# Altium schematic sheet simController.SchDoc
size A2
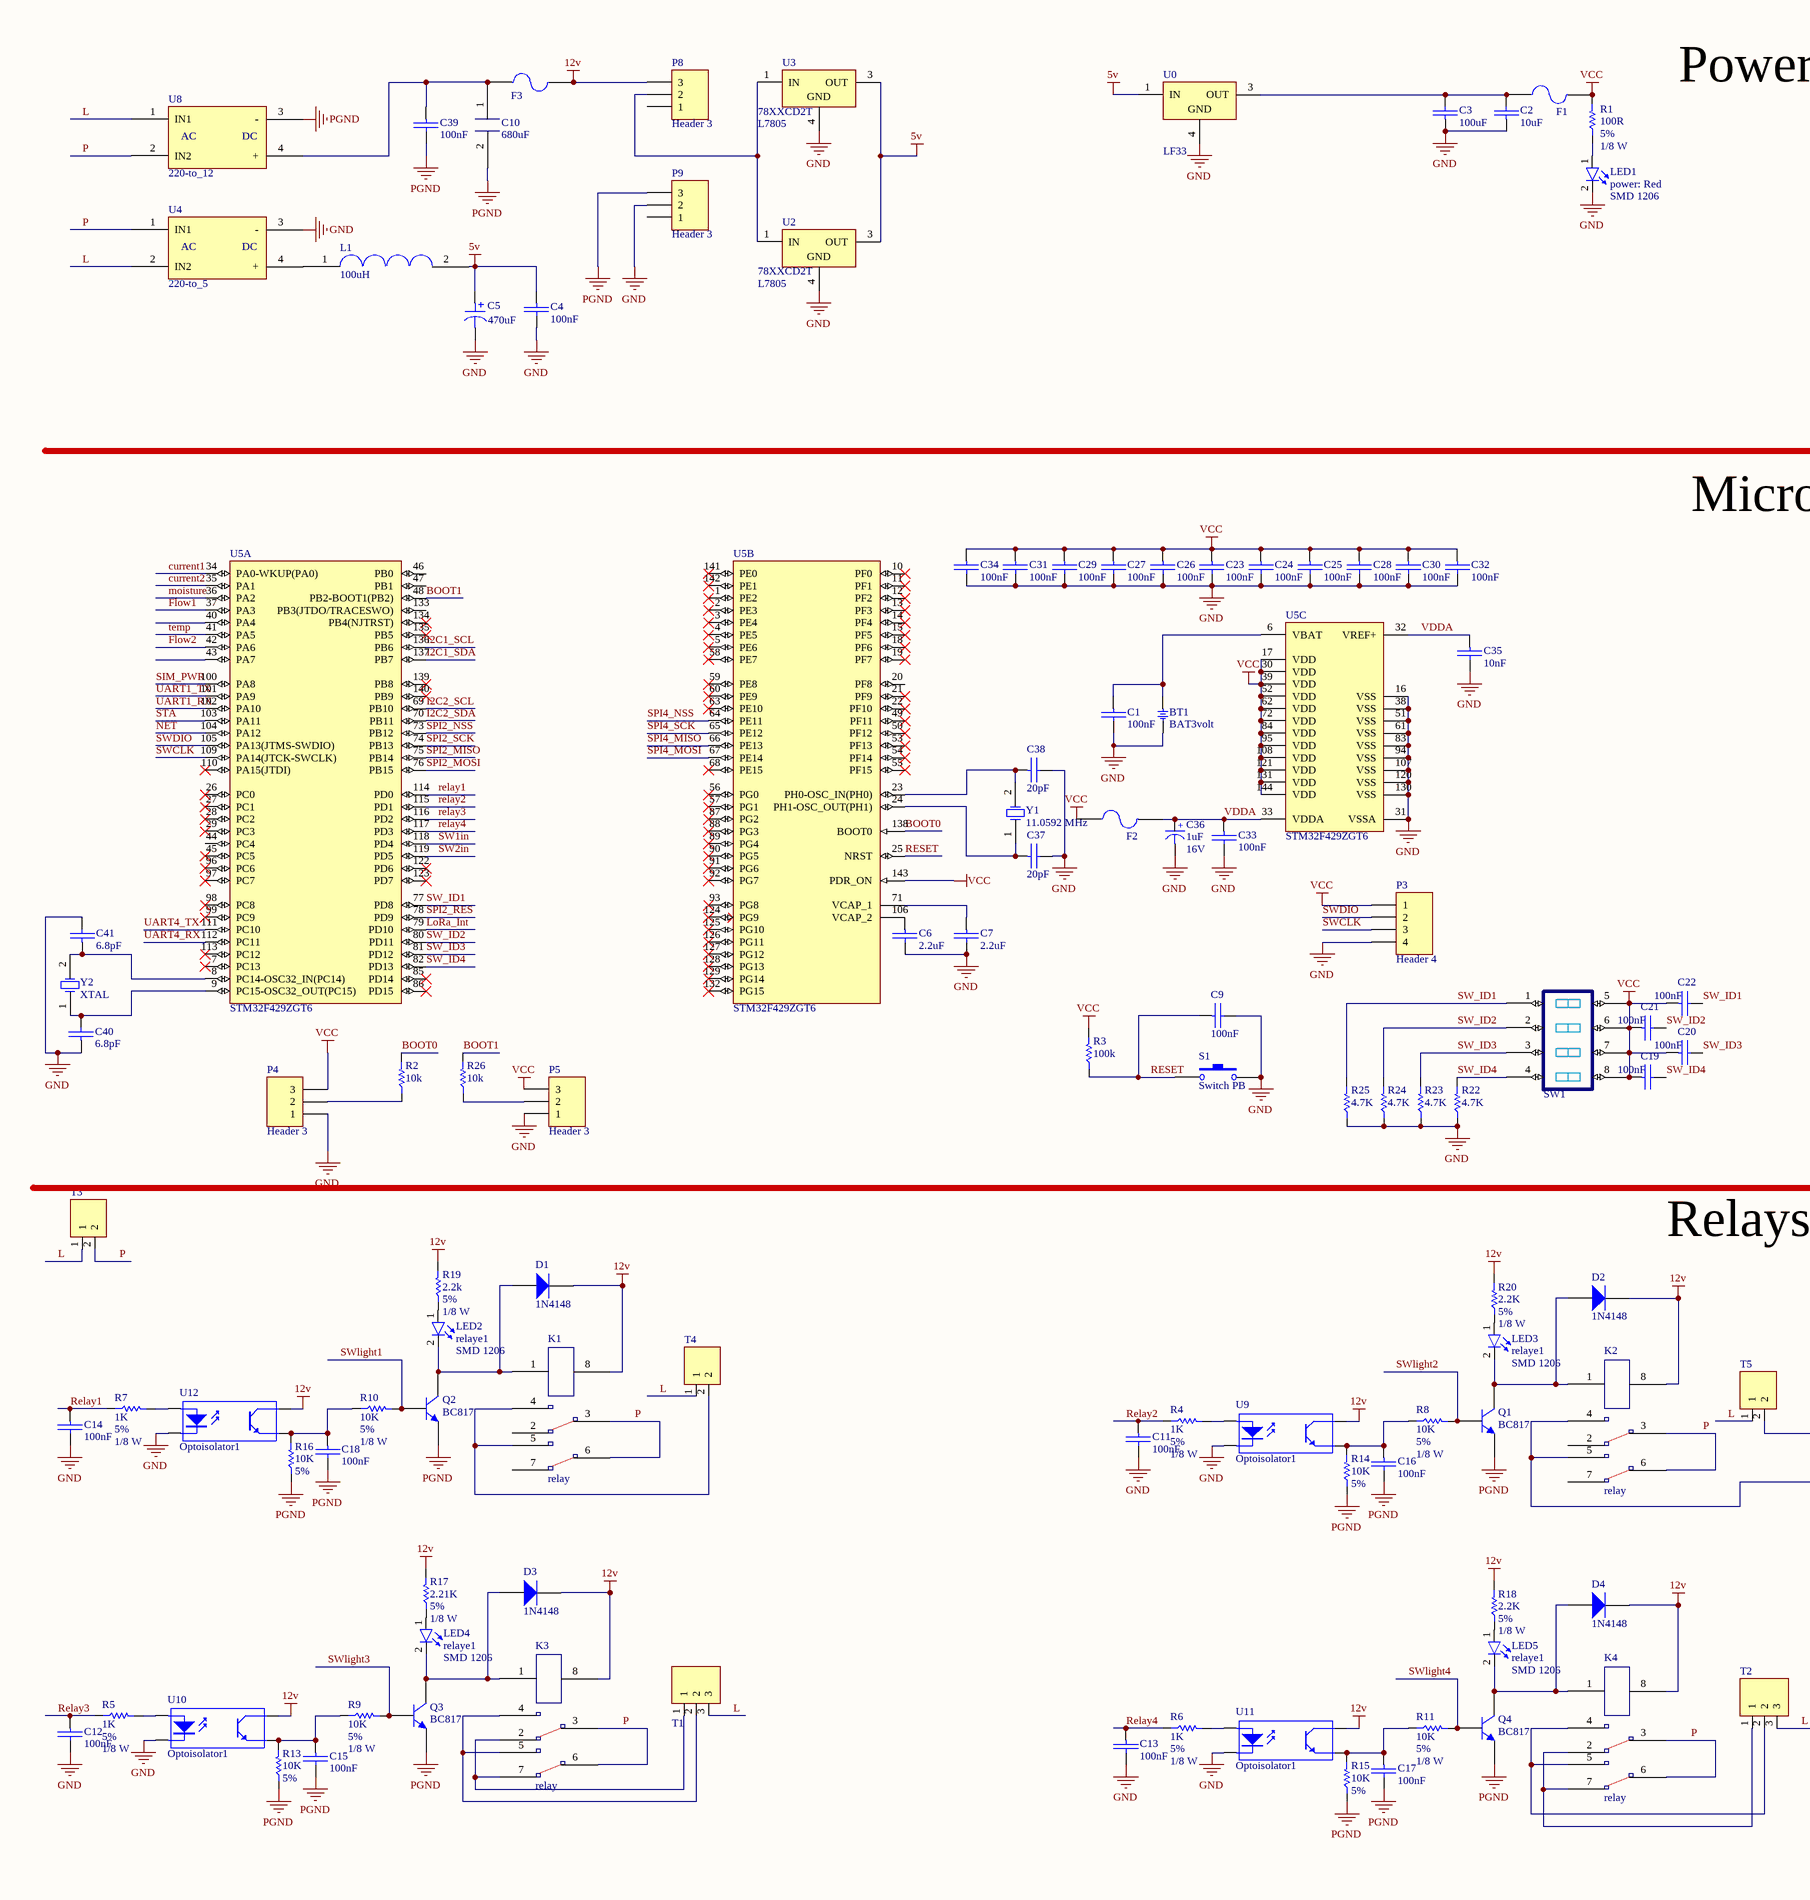
[diagram p0: simController.SchDoc, left]
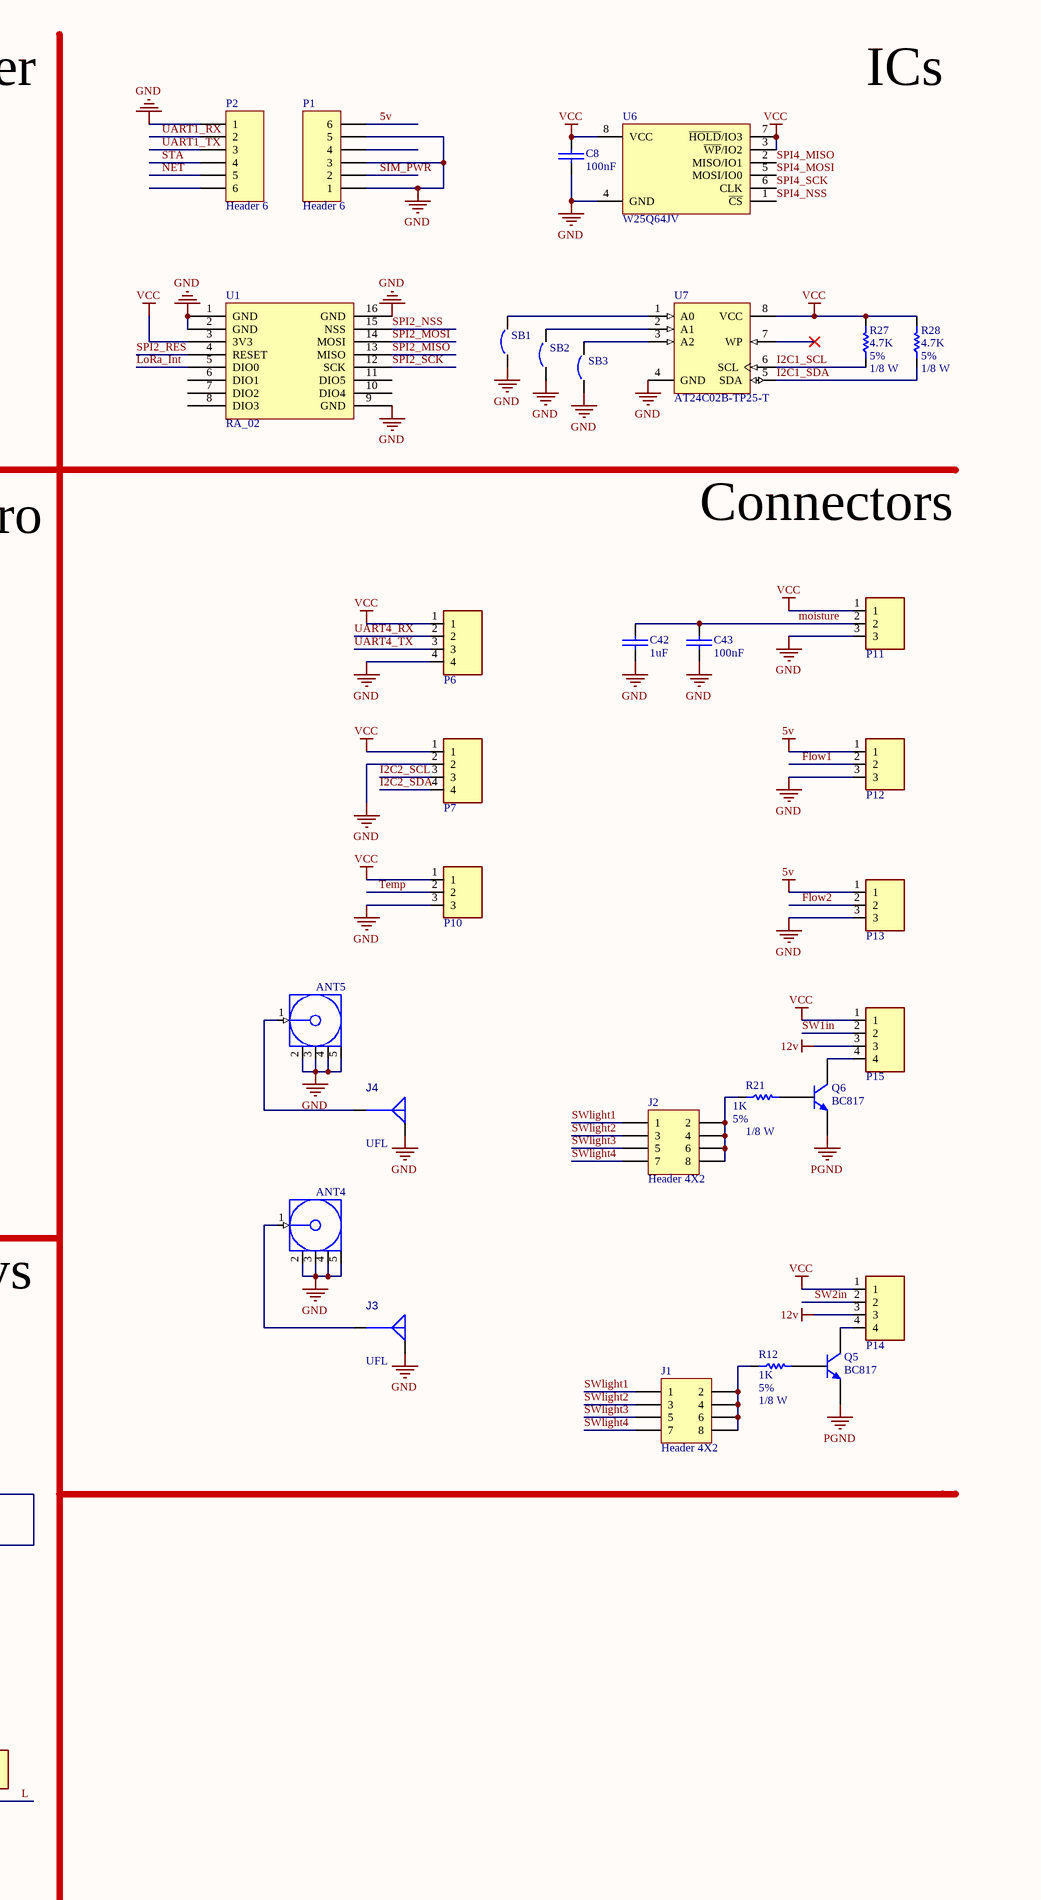
[diagram p1: simController.SchDoc, right]

## Parts
ANT4  SMA  [SMA]  (value not drawn)
ANT5  SMA  [SMA]  (value not drawn)
BT1  BAT3volt  [BTH1220_2032]
C1  100nF  [SMD_CAP_0805]
C2  10uF  [SMD_CAP_0805]
C3  100uF  [SMD_CAP_0805]
C4  100nF  [SMD_CAP_0805]
C5  470uF  [CAP TAN SMD 7343]
C6  2.2uF  [SMD_CAP_0805]
C7  2.2uF  [SMD_CAP_0805]
C8  100nF  [C0805]
C9  100nF  [SMD_CAP_0805]
C10  680uF  [CAP AL SMD D10 H10]
C11  100nF  [C0805]
C12  100nF  [C0805]
C13  100nF  [C0805]
C14  100nF  [C0805]
C15  100nF  [C0805]
C16  100nF  [C0805]
C17  100nF  [C0805]
C18  100nF  [C0805]
C19  100nF  [C0805]
C20  100nF  [C0805]
C21  100nF  [C0805]
C22  100nF  [C0805]
C23  100nF  [SMD_CAP_0805]
C24  100nF  [SMD_CAP_0805]
C25  100nF  [SMD_CAP_0805]
C26  100nF  [SMD_CAP_0805]
C27  100nF  [SMD_CAP_0805]
C28  100nF  [SMD_CAP_0805]
C29  100nF  [SMD_CAP_0805]
C30  100nF  [SMD_CAP_0805]
C31  100nF  [SMD_CAP_0805]
C32  100nF  [SMD_CAP_0805]
C33  100nF  [SMD_CAP_0805]
C34  100nF  [SMD_CAP_0805]
C35  10nF  [SMD_CAP_0805]
C36  Voltage: 16V  [CAPP 1206 (3216X18L) Size A]  (hidden comment: 1uF)
C37  20pF  [SMD_CAP_0805]
C38  20pF  [SMD_CAP_0805]
C39  100nF  [SMD_CAP_0805]
C40  6.8pF  [SMD_CAP_0805]
C41  6.8pF  [SMD_CAP_0805]
C42  1uF  [C0805]
C43  100nF  [C0805]
D1  1N4148  [LL4148]
D2  1N4148  [LL4148]
D3  1N4148  [LL4148]
D4  1N4148  [LL4148]
F1  F=1.0 A  [0805L]  (value not drawn)
F2  F=1.0 A  [1206 FUSE]  (value not drawn)
F3  F=1.0 A  [0805L]  (value not drawn)
J1  Header 4X2  [HDR2X4]
J2  Header 4X2  [HDR2X4]
J3  UFL  [MOLEX SD-734120110]
J4  UFL  [MOLEX SD-734120110]
K1  relay  [relay8pin_omron]
K2  relay  [relay8pin_omron]
K3  relay  [relay8pin_omron]
K4  relay  [relay8pin_omron]
L1  100uH  [INDP11595X40N]
LED1  power: Red  Size: SMD 1206  [LED SMD 1206]
LED2  power: relaye1  Size: SMD 1206  [LED SMD 1206]
LED3  power: relaye1  Size: SMD 1206  [LED SMD 1206]
LED4  power: relaye1  Size: SMD 1206  [LED SMD 1206]
LED5  power: relaye1  Size: SMD 1206  [LED SMD 1206]
P1  Header 6  [HDR1X6]
P2  Header 6  [HDR1X6]
P3  Header 4  [HDR1X4]
P4  Header 3  [HDR1X3]
P5  Header 3  [HDR1X3]
P6  CONN_PWL_4  [XH_4_P2.0]  (value not drawn)
P7  CONN_PWL_4  [XH_4_P2.0]  (value not drawn)
P8  Header 3  [HDR1X3]
P9  Header 3  [HDR1X3]
P10  CONN_PWL_3  [XH_3_P2.0]  (value not drawn)
P11  CONN_PWL_3  [XH_3_P2.0]  (value not drawn)
P12  CONN_PWL_3  [XH_3_P2.0]  (value not drawn)
P13  CONN_PWL_3  [XH_3_P2.0]  (value not drawn)
P14  CONN_PWL_4  [XH_4_P2.0]  (value not drawn)
P15  CONN_PWL_4  [XH_4_P2.0]  (value not drawn)
Q1  BC817  [SOT23_BEC_M]
Q2  BC817  [SOT23_BEC_M]
Q3  BC817  [SOT23_BEC_M]
Q4  BC817  [SOT23_BEC_M]
Q5  BC817  [SOT23_BEC_M]
Q6  BC817  [SOT23_BEC_M]
R1  Tolerance: 5%  Power: 1/8 W  [RES 0805 (2012X06L)]  (hidden comment: 100R)
R2  10k  [RES 0805 (2012X06L)]
R3  100k  [RES 0805 (2012X06L)]
R4  Tolerance: 5%  Power: 1/8 W  [RES 0805 (2012X06L)]  (hidden comment: 1K)
R5  Tolerance: 5%  Power: 1/8 W  [RES 0805 (2012X06L)]  (hidden comment: 1K)
R6  Tolerance: 5%  Power: 1/8 W  [RES 0805 (2012X06L)]  (hidden comment: 1K)
R7  Tolerance: 5%  Power: 1/8 W  [RES 0805 (2012X06L)]  (hidden comment: 1K)
R8  Tolerance: 5%  Power: 1/8 W  [RES 0805 (2012X06L)]  (hidden comment: 10K)
R9  Tolerance: 5%  Power: 1/8 W  [RES 0805 (2012X06L)]  (hidden comment: 10K)
R10  Tolerance: 5%  Power: 1/8 W  [RES 0805 (2012X06L)]  (hidden comment: 10K)
R11  Tolerance: 5%  Power: 1/8 W  [RES 0805 (2012X06L)]  (hidden comment: 10K)
R12  Tolerance: 5%  Power: 1/8 W  [RES 0805 (2012X06L)]  (hidden comment: 1K)
R13  Tolerance: 5%  [RES 0805 (2012X06L)]  (hidden comment: 10K)
R14  Tolerance: 5%  [RES 0805 (2012X06L)]  (hidden comment: 10K)
R15  Tolerance: 5%  [RES 0805 (2012X06L)]  (hidden comment: 10K)
R16  Tolerance: 5%  [RES 0805 (2012X06L)]  (hidden comment: 10K)
R17  Tolerance: 5%  Power: 1/8 W  [RES1206]  (hidden comment: 2.21K)
R18  Tolerance: 5%  Power: 1/8 W  [RES1206]  (hidden comment: 2.2K)
R19  Tolerance: 5%  Power: 1/8 W  [RES1206]  (hidden comment: 2.2k)
R20  Tolerance: 5%  Power: 1/8 W  [RES1206]  (hidden comment: 2.2K)
R21  Tolerance: 5%  Power: 1/8 W  [RES 0805 (2012X06L)]  (hidden comment: 1K)
R22  4.7K  [6-0805_N]
R23  4.7K  [6-0805_N]
R24  4.7K  [6-0805_N]
R25  4.7K  [6-0805_N]
R26  10k  [RES 0805 (2012X06L)]
R27  Tolerance: 5%  Power: 1/8 W  [RES 0805 (2012X06L)]  (hidden comment: 4.7K)
R28  Tolerance: 5%  Power: 1/8 W  [RES 0805 (2012X06L)]  (hidden comment: 4.7K)
S1  Switch PB  [Switch - Push to On]
SB1  Solder Bridge  [Solder Bridge]  (value not drawn)
SB2  Solder Bridge  [Solder Bridge]  (value not drawn)
SB3  Solder Bridge  [Solder Bridge]  (value not drawn)
SW1  DIP_SW_SMD_4PORT  [DIP_SW_SMD_4]  (value not drawn)
T1  CONN_PWL_3  [MSTBV 2,5/3-G-5]  (value not drawn)
T2  CONN_PWL_3  [MSTBV 2,5/3-G-5]  (value not drawn)
T3  CONN_PWL_2  [MSTBV 2,5/2-G-5]  (value not drawn)
T4  CONN_PWL_2  [MSTBV 2,5/2-G-5]  (value not drawn)
T5  CONN_PWL_2  [MSTBV 2,5/2-G-5]  (value not drawn)
U0  LF33  [TO-252]
U1  RA_02  [CAF-200P1700X1900-16N]
U2  78XXCD2T  PartNumber: L7805  [TO263-3]
U3  78XXCD2T  PartNumber: L7805  [TO263-3]
U4  220-to_5  [220to5_3W]
U5  STM32F429ZGT6  [STM-LQFP144_N]  (parts A,B,C of 3)
U6  W25Q64JV  [SOIC-8 5.28X5.28MM P1.27MM]
U7  AT24C02B-TP25-T  [SO8_N]
U8  220-to_12  [220to12_3W]
U9  Optoisolator1  [DIP-4]
U10  Optoisolator1  [DIP-4]
U11  Optoisolator1  [DIP-4]
U12  Optoisolator1  [DIP-4]
Y1  11.0592 MHz  [Crystal SMD]
Y2  XTAL  [R38]

## Nets
5v: C4.2(-) C5.1 L1.2 P1.6 P12.1 P13.1 U0.1(IN) U2.3(OUT) U3.3(OUT)
12v: D1.2(K) D2.2(K) D3.2(K) D4.2(K) F3.2 K1.8 K2.8 K3.8 K4.8 P8.3 P14.3 P15.3 R17.2 R18.2 R19.2 R20.2 U9.4(C) U10.4(C) U11.4(C) U12.4(C)
GND: ANT4.2(GND) ANT4.3(GND) ANT4.4(GND) ANT4.5(GND) ANT5.2(GND) ANT5.3(GND) ANT5.4(GND) ANT5.5(GND) BT1.2 C1.1(+) C2.2(-) C3.2(-) C4.1(+) C5.2 C6.1(+) C7.1(+) C8.1(+) C9.1(+) C11.1(+) C12.1(+) C13.1(+) C14.1(+) C23.1(+) C24.1(+) C25.1(+) C26.1(+) C27.1(+) C28.1(+) C29.1(+) C30.1(+) C31.1(+) C32.1(+) C33.1(+) C34.1(+) C35.1(+) C36.2(-) C37.1(+) C38.1(+) C40.2(-) C41.1(+) C42.1(+) C43.1(+) J3.G J4.G LED1.2(K) P1.1 P1.3 P1.5 P2.1 P3.4 P4.1 P5.1 P6.4 P7.2 P9.2 P10.3 P11.3 P12.3 P13.3 R22.1 R23.1 R24.1 R25.1 S1.2 SB1.1 SB2.1 SB3.1 U0.4(GND) U1.1(GND) U1.2(GND) U1.9(GND) U1.16(GND) U2.4 U3.4 U4.3(-) U5.16(VSS) U5.31(VSSA) U5.38(VSS) U5.51(VSS) U5.61(VSS) U5.83(VSS) U5.94(VSS) U5.107(VSS) U5.120(VSS) U5.130(VSS) U6.4(GND) U7.4(GND) U9.2(K) U10.2(K) U11.2(K) U12.2(K)
PGND: C10.2 C15.1(+) C16.1(+) C17.1(+) C18.1(+) C39.1(+) P9.3 Q1.2(E) Q2.2(E) Q3.2(E) Q4.2(E) Q5.2(E) Q6.2(E) R13.1 R14.1 R15.1 R16.1 U8.3(-)
VCC: C8.2(-) C19.2(-) C20.2(-) C21.2(-) C22.2(-) C23.2(-) C24.2(-) C25.2(-) C26.2(-) C27.2(-) C28.2(-) C29.2(-) C30.2(-) C31.2(-) C32.2(-) C34.2(-) F1.1 F2.2 P3.1 P4.3 P5.3 P6.1 P7.1 P10.1 P11.1 P14.1 P15.1 R1.2 R3.2 R27.2 R28.2 SW1.5(1R) SW1.6(2R) SW1.7(3R) SW1.8(4R) U1.3(3V3) U5.17(VDD) U5.30(VDD) U5.39(VDD) U5.52(VDD) U5.62(VDD) U5.72(VDD) U5.84(VDD) U5.95(VDD) U5.108(VDD) U5.121(VDD) U5.131(VDD) U5.143(PDR_ON) U5.144(VDD) U6.3(~{WP}/IO2) U6.7(~{HOLD}/IO3) U6.8(VCC) U7.8(VCC)
BOOT0: R2.2 U5.138(BOOT0)
BOOT1: R26.2 U5.48(PB2-BOOT1(PB2))
current1: U5.34(PA0-WKUP(PA0))
current2: U5.35(PA1)
Flow1: P12.2 U5.37(PA3)
Flow2: P13.2 U5.42(PA6)
I2C1_SCL: R27.1 U5.136(PB6) U7.6(SCL)
I2C1_SDA: R28.1 U5.137(PB7) U7.5(SDA)
I2C2_SCL: P7.3 U5.69(PB10)
I2C2_SDA: P7.4 U5.70(PB11)
L: T1.3 T2.3 T3.1 T4.1 T5.1 U4.2(IN2) U8.1(IN1)
LoRa_Int: U1.5(DIO0) U5.79(PD10)
moisture: C42.2(-) C43.2(-) P11.2 U5.36(PA2)
NET: P2.5 U5.104(PA12)
P: K1.3 K1.6 K2.3 K2.6 K3.3 K3.6 K4.3 K4.6 T3.2 U4.1(IN1) U8.2(IN2)
relay1: C14.2(-) R7.1 U5.114(PD0)
Relay2: C11.2(-) R4.1 U5.115(PD1)
Relay3: C12.2(-) R5.1 U5.116(PD2)
Relay4: C13.2(-) R6.1 U5.117(PD3)
RESET: C9.2(-) R3.1 S1.1 U5.25(NRST)
SIM_PWR: P1.2 U5.100(PA8)
SPI2_MISO: U1.13(MISO) U5.75(PB14)
SPI2_MOSI: U1.14(MOSI) U5.76(PB15)
SPI2_NSS: U1.15(NSS) U5.73(PB12)
SPI2_RES: U1.4(RESET) U5.78(PD9)
SPI2_SCK: U1.12(SCK) U5.74(PB13)
SPI4_MISO: U5.66(PE13) U6.2(MISO/IO1)
SPI4_MOSI: U5.67(PE14) U6.5(MOSI/IO0)
SPI4_NSS: U5.64(PE11) U6.1(~{CS})
SPI4_SCK: U5.65(PE12) U6.6(CLK)
STA: P2.4 U5.103(PA11)
SW1in: P15.2 U5.118(PD4)
SW2in: P14.2 U5.119(PD5)
SW_ID1: C22.1(+) R25.2 SW1.1(1L) U5.77(PD8)
SW_ID2: C21.1(+) R24.2 SW1.2(2L) U5.80(PD11)
SW_ID3: C20.1(+) R23.2 SW1.3(3L) U5.81(PD12)
SW_ID4: C19.1(+) R22.2 SW1.4(4L) U5.82(PD13)
SWCLK: P3.3 U5.109(PA14(JTCK-SWCLK))
SWDIO: P3.2 U5.105(PA13(JTMS-SWDIO))
SWlight1: J1.1 J2.1 Q2.1(B) R10.2
SWlight2: J1.3 J2.3 Q1.1(B) R8.2
SWlight3: J1.5 J2.5 Q3.1(B) R9.2
SWlight4: J1.7 J2.7 Q4.1(B) R11.2
Temp: P10.2 U5.41(PA5)
UART1_RX: P2.2 U5.102(PA10)
UART1_TX: P2.3 U5.101(PA9)
UART4_RX: P6.2 U5.112(PC11)
UART4_TX: P6.3 U5.111(PC10)
VDDA: C33.2(-) C35.2(-) C36.1(+) F2.1 U5.32(VREF+) U5.33(VDDA)
NetANT4_1: ANT4.1(Signal) J3.S
NetANT5_1: ANT5.1(Signal) J4.S
NetBT1_1: BT1.1 C1.2(-) U5.6(VBAT)
NetC2_1: C2.1(+) C3.1(+) F1.2 U0.3(OUT)
NetC6_2: C6.2(-) U5.106(VCAP_2)
NetC7_2: C7.2(-) U5.71(VCAP_1)
NetC10_1: C10.1 C39.2(-) F3.1 U8.4(+)
NetC15_2: C15.2(-) R9.1 R13.2 U10.3(E)
NetC16_2: C16.2(-) R8.1 R14.2 U9.3(E)
NetC17_2: C17.2(-) R11.1 R15.2 U11.3(E)
NetC18_2: C18.2(-) R10.1 R16.2 U12.3(E)
NetC37_2: C37.2(-) U5.24(PH1-OSC_OUT(PH1)) Y1.1(OSC1)
NetC38_2: C38.2(-) U5.23(PH0-OSC_IN(PH0)) Y1.2(OSC2)
NetC40_1: C40.1(+) U5.9(PC15-OSC32_OUT(PC15)) Y2.1(OSC1)
NetC41_2: C41.2(-) U5.8(PC14-OSC32_IN(PC14)) Y2.2(OSC2)
NetD1_1: D1.1(A) K1.1 LED2.2(K) Q2.3(C)
NetD2_1: D2.1(A) K2.1 LED3.2(K) Q1.3(C)
NetD3_1: D3.1(A) K3.1 LED4.2(K) Q3.3(C)
NetD4_1: D4.1(A) K4.1 LED5.2(K) Q4.3(C)
NetJ1_2: J1.2 J1.4 J1.6 J1.8 R12.1
NetJ2_2: J2.2 J2.4 J2.6 J2.8 R21.1
NetK1_4: K1.4 K1.5 T4.2
NetK2_4: K2.4 K2.5 T5.2
NetK3_2: K3.2 K3.7 T1.1
NetK3_4: K3.4 K3.5 T1.2
NetK4_2: K4.2 K4.7 T2.1
NetK4_4: K4.4 K4.5 T2.2
NetL1_1: L1.1 U4.4(+)
NetLED1_1: LED1.1(A) R1.1
NetLED2_1: LED2.1(A) R19.1
NetLED3_1: LED3.1(A) R20.1
NetLED4_1: LED4.1(A) R17.1
NetLED5_1: LED5.1(A) R18.1
NetP4_2: P4.2 R2.1
NetP5_2: P5.2 R26.1
NetP8_2: P8.2 U2.1(IN) U3.1(IN)
NetP14_4: P14.4 Q5.3(C)
NetP15_4: P15.4 Q6.3(C)
NetQ5_1: Q5.1(B) R12.2
NetQ6_1: Q6.1(B) R21.2
NetR4_2: R4.2 U9.1(A)
NetR5_2: R5.2 U10.1(A)
NetR6_2: R6.2 U11.1(A)
NetR7_2: R7.2 U12.1(A)
NetSB1_2: SB1.2 U7.1(A0)
NetSB2_2: SB2.2 U7.2(A1)
NetSB3_2: SB3.2 U7.3(A2)

Not connected (* = marked no-connect by the designer): K1 2 7; K2 2 7; P1 4; P2 6; P8 1; P9 1; U1 6(DIO1) 7(DIO2) 8(DIO3) 10(DIO4) 11(DIO5); U5 1(PE2)* 2(PE3)* 3(PE4)* 4(PE5)* 5(PE6)* 7(PC13)* 10(PF0)* 11(PF1)* 12(PF2)* 13(PF3)* 14(PF4)* 15(PF5)* 18(PF6)* 19(PF7)* 20(PF8) 21(PF9)* 22(PF10)* 26(PC0)* 27(PC1)* 28(PC2)* 29(PC3)* 40(PA4) 43(PA7) 44(PC4) 45(PC5)* 46(PB0) 47(PB1) 49(PF11)* 50(PF12)* 53(PF13)* 54(PF14)* 55(PF15)* 56(PG0)* 57(PG1)* 58(PE7)* 59(PE8)* 60(PE9)* 63(PE10)* 68(PE15)* 85(PD14)* 86(PD15)* 87(PG2)* 88(PG3)* 89(PG4)* 90(PG5)* 91(PG6)* 92(PG7)* 93(PG8)* 96(PC6)* 97(PC7)* 98(PC8)* 99(PC9)* 110(PA15(JTDI))* 113(PC12)* 122(PD6)* 123(PD7)* 124(PG9)* 125(PG10)* 126(PG11)* 127(PG12)* 128(PG13)* 129(PG14)* 132(PG15)* 133(PB3(JTDO/TRACESWO)) 134(PB4(NJTRST))* 135(PB5)* 139(PB8)* 140(PB9)* 141(PE0)* 142(PE1)*; U7 7(WP)*

## Notes on the sheet
- Power
- ICs
- Micro
- Connectors
- Relays
- (in symbol 78XXCD2T) GND
- (in symbol H-Link) AC; DC

## Library data of the parts
ANT4 ANT5 = SMA: RF Coaxial PCB Connector, MCX; Thru-Hole, Right-Angle Mount Socket, Blunt Post Terminal, 50 Ohm Impedance
BT1 = Battery CR1220_CR2032: BATTERY HOLDER, CR1220/CR2032; VALUE: BAT3volt; MANF_P#: -; .: http://www.chila.ir
C1-C4 C6-C9 C11-C35 C37-C43 = Cap-Bipolar: Bipolar Capacitor; Voltage: 100V; Designer: Saeid Jorablo; Organazation: ControTec; Adding Date: 1387/12/20
  C1 C4 C8 C9 C11-C34 C39 C43: Value: 100nF
  C2: Value: 10uF
  C3: Value: 100uF
  C6 C7: Value: 2.2uF
  C35: Value: 10nF
  C37 C38: Value: 20pF
  C40 C41: Value: 6.8pF
  C42: Value: 1uF
C5 = Pol Cap SMD TAN 7343 SIZE D: SMT TAN Polarised Capacitor; Value: 470uF
C10 = tantalum_capacitor
C36 = Cap-Polar: Polar Capacitor; Designer: Saeid Jorablo; Organazation: ControTec; Adding Date: 1387/12/20; Value: 1uF
D1-D4 = Diode 1N4148: High Conductance Fast Diode; Published: 8-Jun-2000; LatestRevisionDate: 17-Jul-2002; LatestRevisionNote: Re-released for DXP Platform.; DatasheetVersion: 1997; PackageReference: DO-35; Publisher: Altium Limited; PackageDescription: Diode, Axial; Body 3.8 x 1.9 mm (LxDia. max), Lead Dia. 0.53 mm (max); Code_JEDEC: DO-204-AH; ComponentLink1Description: Manufacturer Link; ComponentLink1URL: http://www.fairchildsemi.com/; ComponentLink2Description: Datasheet; ComponentLink2URL: http://www.fairchildsemi.com/ds/1N%2F1N4148.pdf
F1-F3 = Fuse SMD1206: SMD Fuses 1206; Designer: Abbas Basereh; Desc.: SMD Fuses 1206; Data: 16-12-2016
J1 J2 = Header 4X2: Header, 4-Pin, Dual row; LatestRevisionDate: 17-Jul-2002; LatestRevisionNote: Re-released for DXP Platform.; Publisher: Altium Limited
J3 J4 = UFL MOLEX SD-734120110: PartNumber: MOLEX SD-734120110
L1 = inductor
LED1-LED5 = LED: Designer: Saeid Jorablo; Organazation: ControTec; Adding Date: 1387/12/22
P1 P2 = Header 6: Header, 6-Pin; LatestRevisionDate: 17-Jul-2002; LatestRevisionNote: Re-released for DXP Platform.; Publisher: Altium Limited
P3 = Header 4: Header, 4-Pin; LatestRevisionDate: 17-Jul-2002; LatestRevisionNote: Re-released for DXP Platform.; Publisher: Altium Limited
P4 P5 P8 P9 = Header 3: Header, 3-Pin; LatestRevisionDate: 17-Jul-2002; LatestRevisionNote: Re-released for DXP Platform.; Publisher: Altium Limited
P6 P7 P14 P15 = XH P2.0 4Pin: VALUE: CONN_PWL_4
P10-P13 = XH P2.0 3Pin: VALUE: CONN_PWL_3
Q1-Q6 = NPN: NPN Bipolar Transistor; Published: 8-Jun-2000; LatestRevisionDate: 29-May-2009; LatestRevisionNote: IPC-7351 Footprint Added.; PackageVersion: Aug-1999; PackageReference: SOT-23B; Publisher: Altium Limited; PackageDescription: 3-Pin SOT-23 Package 0.95 mm Pitch, 2.4 mm Lead Span
R1-R21 R26-R28 = Resistor
  R1: Value: 100R
  R2 R26: Value: 10k
  R3: Value: 100k
  R4-R7 R12 R21: Value: 1K
  R8-R11 R13-R16: Value: 10K
  R17: Value: 2.21K
  R18 R20: Value: 2.2K
  R19: Value: 2.2k
  R27 R28: Value: 4.7K
R22-R25 = Resistor: Tolerance: 5%; Power: 1/8 W; Value: 4.7K
S1 = Switch PB: Push Button Switch
SW1 = DIP_SW_4: 4-KEY-DIP-SWITCH_SMD; SupplierLink: https://eshop.eca.ir/%D8%AF%DB%8C%D9%BE-%D8%B3%D9%88%D8%A6%DB%8C%DA%86/3343-%D8%AF%DB%8C%D9%BE-%D8%B3%D9%88%D8%A6%DB%8C%DA%86-4-%D8%AA%D8%A7%DB%8C%DB%8C-smd.html
T1 T2 = Power_3: Power Terminal 3pin,Header, 3-Pin; VALUE: CONN_PWL_3
T3-T5 = Power_2: Power Terminal 2pin,Header, 2-Pin; VALUE: CONN_PWL_2
U0 = LF33 (SMD): 500mA, Very Low Drop (0.45V) Voltage Regulator, 3.3V, 3-Pin DPAK, Tape and Reel; PartNumber: LF33CDT-TR; DatasheetVersion: Nov-2010; PackageVersion: 2011; PackageReference: TO-252; PackageDescription: 3-Pin Transistor Outline Package 2.28 mm Pitch, 9.7 mm Lead Span (DPAK); ComponentLink1Description: Manufacturer URL; ComponentLink1URL: http://www.st.com; ComponentLink2Description: Datasheet; ComponentLink2URL: http://www.st.com/internet/com/TECHNICAL_RESOURCES/TECHNICAL_LITERATURE/DATASHEET/CD00000546.pdf
U2 U3 = 78XXCD2T: Positive Voltage Regulator, 3-Pin D2PAK, Tape and Reel; ComponentLink1Description: Manufacturer URL; ComponentLink1URL: http://www.st.com; ComponentLink2Description: Datasheet; ComponentLink2URL: http://www.st.com/internet/com/TECHNICAL_RESOURCES/TECHNICAL_LITERATURE/DATASHEET/CD00000444.pdf
U4 U8 = H-Link: Isolated 3W Power Module
U5 = STM32F429ZGT6: ARM Cortex-M4 32-bit MCU+FPU, 225 DMIPS, 1024 kB Flash, 256 kB Internal RAM, 114 I/Os, 144-pin LQFP, -40 to 85 degC, Tray; Manufacturer: STMicroelectronics; D/A Converter: 2x12-bit; FLASH Size (Prog) (kB): 1024; I/Os (High Current): 114; Internal RAM Size (kB): 256; Operating Frequency(F) (Processor speed) (MHz): 180; Supply Voltage(Vcc) max (V): 3.6; Supply Voltage(Vcc) min (V): 1.8; DatasheetVersion: Rev. 2; PackageVersion: Rev. 4, 06/2013; PackageReference: LQFP144; PackageDescription: 144-Pin Low Profile Quad Flat Package, 20 x 20 mm Body, 0.5 mm Pitch; Supplier 1: Digi-Key; Supplier Part Number 1: STM32F429ZGT6-ND; Supplier 2: Newark; Supplier Part Number 2: 06X3675; Supplier 3: Mouser; Supplier Part Number 3: 511-STM32F429ZGT6; Core: ARM Cortex-M4; Packing: Tray; Mounting Technology: Surface Mount; PartNumber: STM32F429ZGT6; ComponentLink1Description: Manufacturer URL; ComponentLink1URL: http://www.st.com/web/en/home.html; ComponentLink2Description: Datasheet; ComponentLink2URL: http://www.st.com/st-web-ui/static/active/en/resource/technical/document/data_brief/DM00053488.pdf; ComponentLink3Description: Package Specification; ComponentLink3URL: http://www.st.com/st-web-ui/static/active/en/resource/technical/document/datasheet/DM00037051.pdf
U6 = W25Q64 (SMD SOIC W): FLASH - NOR Memory IC 64Mb (8M x 8) SPI - Quad I/O 133MHz  8-SOIC; PartNumber: W25Q64JVSSIM TR
U7 = AT24C02B-TP25-T: 2Kbit (256 x 8), 2-wire Bus Automotive Serial EEPROM with full memory Write Protect, 2.5V, 8-Pin TSSOP, Tape & Reel; DatasheetVersion: 8517C,  Jan-2009; PackageVersion: revD, Dec-2009; PackageReference: 8A2; PackageDescription: 8-Lead, 4.4 mm Body, Plastic Thin Shrink Small Outline Package (TSSOP); Code_JEDEC: MO-153-AA; ComponentLink1Description: Manufacturer URL; ComponentLink1URL: http://www.atmel.com/; ComponentLink2Description: Datasheet; ComponentLink2URL: http://www.atmel.com/dyn/resources/prod_documents/doc8517.pdf
U9-U12 = Optoisolator1: 4-Pin Phototransistor Optocoupler; Published: 24-Mar-1999; LatestRevisionDate: 04-Mar-2005; LatestRevisionNote: Sch pins 3 & 4 Swapped.; DatasheetVersion: Nov-2003; PackageReference: DIP-4; Publisher: Altium Limited
Y1 = XTAL: XTAL Crystal; Company: E.P.I.L; Design Date: 11/04/2011; Value: 11.0592 MHz
Y2 = XTAL: Crystal Oscillator; Published: 8-Jun-2000; LatestRevisionDate: 17-Jul-2002; LatestRevisionNote: Re-released for DXP Platform.; PackageReference: R38; Publisher: Altium Limited; PackageDescription: Crystal, Thru-Hole; 2 Leads; Body 3.1 x 8.2 mm (Dia.xH)